# Altium schematic sheet Signal_TX.SchDoc: Signal_TX
size A4
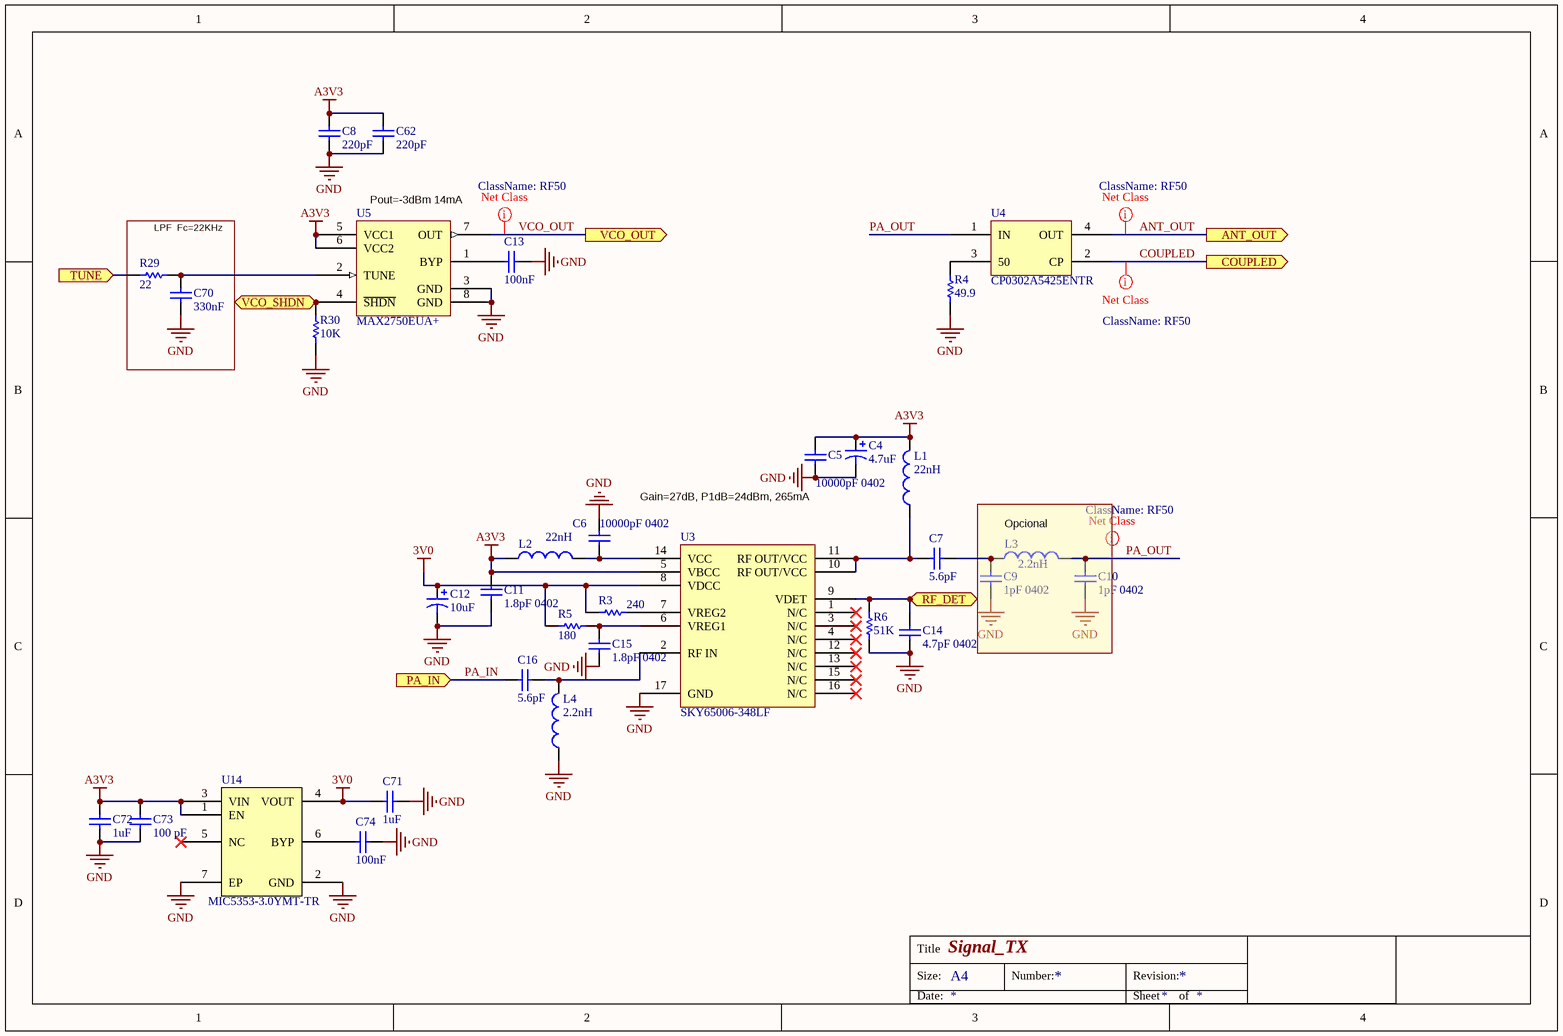
[diagram p0: Signal_TX.SchDoc]

## Parts
C4  4.7uF  [0603 Cap]
C5  10000pF 0402  [RESC1005X04L]
C6  10000pF 0402  [RESC1005X04L]
C7  5.6pF  [RESC1005X04L]
C8  220pF  [0603 Cap]
C9  1pF 0402  [CAPC1005X05L]
C10  1pF 0402  [CAPC1005X05L]
C11  1.8pF 0402  [CAPC1005X05L]
C12  10uF  [CAPC3216X09L]
C13  100nF  [0603 Cap]
C14  4.7pF 0402  [RESC1005X04L]
C15  1.8pF 0402  [CAPC1005X05L]
C16  5.6pF  [RESC1005X04L]
C62  220pF  [0603 Cap]
C70  330nF  [0603 Cap]
C71  1uF  [0603 Cap]
C72  1uF  [0603 Cap]
C73  100 pF  [CAPC1005X05L]
C74  100nF  [0603 Cap]
L1  22nH  [RESC1005X04L]
L2  22nH  [RESC1005X04L]
L3  2.2nH  [RESC1005X04L]
L4  2.2nH  [RESC1005X04L]
R3  240  [RESC1005X04L]
R4  49.9  [RESC1005X04L]
R5  180  [RESC1005X04L]
R6  51K  [RESC1005X04L]
R29  22  [0603 Res]
R30  10K  [0603 Res]
U3  SKY65006-348LF  [QFN50P300X300X100_HS-17N]
U4  CP0302A5425ENTR  [DFN60P65X25-4N]
U5  MAX2750EUA+  [uSOP-8 uMAX]
U14  MIC5353-3.0YMT-TR  [SON50P160X55_HS-7N]

## Blocks framed on the sheet
LPF  Fc=22KHz: C70 R29
Opcional: C9 C10 L3

## Ports
ANT_OUT (out), COUPLED (out), PA_IN (in), RF_DET (out), TUNE (in), VCO_OUT (out), VCO_SHDN (in)

## Nets
3V0: C12.1 C71.1 R3.2 R5.2 U3.8(VDCC) U14.4(VOUT)
A3V3: C4.1 C5.2 C8.2 C11.2 C62.2 C72.2 C73.2 L1.2 L2.1 U3.5(VBCC) U5.5(VCC1) U5.6(VCC2) U14.1(EN) U14.3(VIN)
GND: C4.2 C5.1 C6.2 C8.1 C9.1 C10.1 C11.1 C12.2 C13.1 C14.1 C15.1 C62.1 C70.1 C71.2 C72.1 C73.1 C74.2 L4.1 R4.1 R6.1 R30.1 U3.17(GND) U5.3(GND) U5.8(GND) U14.2(GND) U14.7(EP)
ANT_OUT: U4.4(OUT) ; port ANT_OUT
COUPLED: U4.2(CP) ; port COUPLED
PA_IN: C16.1 ; port PA_IN
PA_OUT: C10.2 L3.2 U4.1(IN)
RF_DET: C14.2 R6.2 U3.9(VDET) ; port RF_DET
TUNE: R29.1 ; port TUNE
VCO_OUT: U5.7(OUT) ; port VCO_OUT
VCO_SHDN: R30.2 U5.4(~{SHDN}) ; port VCO_SHDN
NetC6_1: C6.1 L2.2 U3.14(VCC)
NetC7_1: C7.1 L1.1 U3.10(RF_OUT/VCC) U3.11(RF_OUT/VCC)
NetC7_2: C7.2 C9.2 L3.1
NetC13_2: C13.2 U5.1(BYP)
NetC15_2: C15.2 R5.1 U3.6(VREG1)
NetC16_2: C16.2 L4.2 U3.2(RF_IN)
NetC70_2: C70.2 R29.2 U5.2(TUNE)
NetC74_1: C74.1 U14.6(BYP)
NetR3_1: R3.1 U3.7(VREG2)
NetR4_2: R4.2 U4.3(50)

Not connected (* = marked no-connect by the designer): U3 1(N/C)* 3(N/C)* 4(N/C)* 12(N/C)* 13(N/C)* 15(N/C)* 16(N/C)*; U14 5(NC)*

## Layout directives
net class RF50: ANT_OUT, COUPLED, PA_OUT, VCO_OUT

## Notes on the sheet
- (near U5) Pout=-3dBm 14mA
- Gain=27dB, P1dB=24dBm, 265mA
- Title
- Size:
- A4
- Number:
- Revision:
- Date:
- Sheet
- of

## Library data of the parts
C4 = F981A475MMA: CAP TANT 4.7UF 10V 20% 0603; Manufacturer: AVX Corporation; Manufacturer Size Code: M; Type: Molded; ESR (Equivalent Series Resistance): 6 Ohm; Supplier 1: Digi-Key; Manufacturer Part Number: F981A475MMA; RoHS: RoHS Compliant; Category: Capacitors; Stock 1: 44000; Pricing 1: 4000=0.15246, 8000=0.1423, 12000=0.13975, 28000=0.13721 (EUR); Packaging: Tape & Reel (TR); Part Status: Active; Tolerance: ±20%; Operating Temperature: -55°C ~ 125°C; Lifetime @ Temp.: -; Mounting Type: Surface Mount; Package / Case: 0603 (1608 Metric); Size / Dimension: 0.063" L x 0.033" W (1.60mm x 0.85mm); Height - Seated (Max): 0.035" (0.90mm); Lead Spacing: -; Features: General Purpose; Failure Rate: -; ComponentLink1URL: http://datasheets.avx.com/F98.pdf; ComponentLink1Description: http://datasheets.avx.com/F98.pdf; Supplier Part Number 1: 478-8651-2-ND
C5 C6 = GRM155R71E103KA01J: CAP CER 10000PF 25V X7R 0402; Manufacturer: Murata Electronics North America; Tolerance: ±10%; Supplier 1: Digi-Key; Manufacturer Part Number: GRM155R71E103KA01J; RoHS: RoHS Compliant; Category: Capacitors; Stock 1: 146109; Pricing 1: 1=0.16, 10=0.021, 100=0.009, 500=0.00648, 1000=0.0051, 2500=0.00463, 5000=0.00426 (EUR); Packaging: Digi-Reel®; Part Status: Active; Voltage - Rated: 25V; Temperature Coefficient: X7R; Operating Temperature: -55°C ~ 125°C; Features: -; Ratings: -; Applications: General Purpose; Mounting Type: Surface Mount, MLCC; Package / Case: 0402 (1005 Metric); Size / Dimension: 0.039" L x 0.020" W (1.00mm x 0.50mm); Height - Seated (Max): -; Thickness (Max): 0.022" (0.55mm); Lead Spacing: -; ComponentLink1URL: http://www.murata.com/~/media/webrenewal/support/library/catalog/products/capacitor/mlcc/c02e.ashx; ComponentLink1Description: http://www.murata.com/~/media/webrenewal/support/library/catalog/products/capacitor/mlcc/c02e.ashx; Supplier Part Number 1: 490-6341-6-ND
C7 C16 = 04025A5R6CAT2A: AVX - 04025A5R6CAT2A - COND, MLCC, C0G/NP0, 5.6PF, 50V, 0402; Tolerance: ±10%; Voltage - Rated: 25V; Temperature Coefficient: X7R; Supplier 1: Farnell; Manufacturer: AVX; Manufacturer Part Number: 04025A5R6CAT2A; RoHS: YES; Stock 1: 52484; Pricing 1: 10=0,187, 100=0,0374, 500=0,015, 2500=0,0094, 5000=0,0075 (EUR); ComponentLink1URL: http://www.avx.com/docs/Catalogs/cpack.pdf; ComponentLink1Description: http://www.avx.com/docs/Catalogs/cpack.pdf; ComponentLink2URL: http://www.farnell.com/datasheets/2068140.pdf; ComponentLink2Description: http://www.farnell.com/datasheets/2068140.pdf; Supplier Part Number 1: 1327642; Supplier 2: Digi-Key; Category: Capacitors; Stock 2: 146109; Pricing 2: 1=0.16, 10=0.021, 100=0.009, 500=0.00648, 1000=0.0051, 2500=0.00463, 5000=0.00426 (EUR); Packaging: Cut Tape (CT); Part Status: Active; Operating Temperature: -55°C ~ 125°C; Features: -; Ratings: -; Applications: General Purpose; Mounting Type: Surface Mount, MLCC; Package / Case: 0402 (1005 Metric); Size / Dimension: 0.039" L x 0.020" W (1.00mm x 0.50mm); Height - Seated (Max): -; Thickness (Max): 0.022" (0.55mm); Lead Spacing: -; ComponentLink3URL: http://www.murata.com/~/media/webrenewal/support/library/catalog/products/capacitor/mlcc/c02e.ashx; ComponentLink3Description: http://www.murata.com/~/media/webrenewal/support/library/catalog/products/capacitor/mlcc/c02e.ashx; Supplier Part Number 2: 490-6341-1-ND
C8 C62 = CL10B221KB8WPNC: CAP CER 220PF 50V X7R 0603; Manufacturer: Samsung Electro-Mechanics America, Inc.; Tolerance: ±10%; Supplier 1: Digi-Key; Manufacturer Part Number: CL10B221KB8WPNC; RoHS: RoHS Compliant; Category: Capacitors; Stock 1: 28547; Pricing 1: 1=0.09, 10=0.027, 100=0.0123, 500=0.0088, 1000=0.00691 (EUR); Packaging: Cut Tape (CT); Part Status: Active; Voltage - Rated: 50V; Temperature Coefficient: X7R; Operating Temperature: -55°C ~ 125°C; Features: Open Mode, Soft Termination; Ratings: AEC-Q200; Applications: Automotive, Boardflex Sensitive; Mounting Type: Surface Mount, MLCC; Package / Case: 0603 (1608 Metric); Size / Dimension: 0.063" L x 0.031" W (1.60mm x 0.80mm); Height - Seated (Max): -; Thickness (Max): 0.035" (0.90mm); Lead Spacing: -; Lead Style: -; ComponentLink1URL: http://www.samsungsem.com/kr/support/library/product-catalog/mlcc.jsp; ComponentLink1Description: http://www.samsungsem.com/kr/support/library/product-catalog/mlcc.jsp; Supplier Part Number 1: 1276-6536-1-ND
C9 C10 = GRM1555C1H1R0CA01D: CAP CER 1PF 50V C0G/NP0 0402
C11 C15 = GRM1555C1H1R8CZ01D: CAP CER 1.8PF 50V C0G/NP0 0402; Manufacturer: Murata Electronics North America; Tolerance: ±0.25pF; Temperature Coefficient: C0G, NP0; Type: Multilayer; Material - Core: Non-Magnetic; Inductance: 22nH; Current Rating: 200mA; Shielding: Unshielded; DC Resistance (DCR): 700 mOhm Max; Q @ Freq: 7 @ 100MHz; Frequency - Self Resonant: 3.5GHz; Supplier 1: Digi-Key; Manufacturer Part Number: GRM1555C1H1R8CZ01D; RoHS: RoHS Compliant; Category: Capacitors; Stock 1: 0; Pricing 1: 1=0 (EUR); Packaging: Cut Tape (CT); Part Status: Obsolete; Voltage - Rated: 50V; Operating Temperature: -55°C ~ 125°C; Features: -; Ratings: -; Applications: General Purpose; Mounting Type: Surface Mount, MLCC; Package / Case: 0402 (1005 Metric); Size / Dimension: 0.039" L x 0.020" W (1.00mm x 0.50mm); Height - Seated (Max): -; Thickness (Max): 0.022" (0.55mm); Lead Spacing: -; Lead Style: -; ComponentLink1URL: http://media.digikey.com/pdf/Data%20Sheets/Murata%20PDFs/Chip_Mono_Cer_Caps_C02e_Rev_Dec2016.pdf; ComponentLink1Description: http://media.digikey.com/pdf/Data%20Sheets/Murata%20PDFs/Chip_Mono_Cer_Caps_C02e_Rev_Dec2016.pdf; Supplier Part Number 1: 490-3203-1-ND; Current - Saturation: -; Supplier Device Package: 0402 (1005 Metric); ComponentLink2URL: https://product.tdk.com/info/en/catalog/datasheets/inductor_commercial_high-frequency_mlk1005_en.pdf; ComponentLink2Description: https://product.tdk.com/info/en/catalog/datasheets/inductor_commercial_high-frequency_mlk1005_en.pdf
C12 = TAJA106M006RNJ: CAP TANT 10UF 6.3V 20% 1206; Manufacturer: AVX Corporation; Manufacturer Size Code: A; Type: Molded; ESR (Equivalent Series Resistance): 4 Ohm; Supplier 1: Digi-Key; Manufacturer Part Number: TAJA106M006RNJ; RoHS: RoHS Compliant; Category: Capacitors; Stock 1: 16813; Pricing 1: 1=0.47, 10=0.326, 100=0.2146, 500=0.15896, 1000=0.13512 (EUR); Packaging: Cut Tape (CT); Part Status: Active; Tolerance: ±20%; Operating Temperature: -55°C ~ 125°C; Lifetime @ Temp.: -; Mounting Type: Surface Mount; Package / Case: 1206 (3216 Metric); Size / Dimension: 0.126" L x 0.063" W (3.20mm x 1.60mm); Height - Seated (Max): 0.071" (1.80mm); Lead Spacing: -; Features: General Purpose; Failure Rate: -; ComponentLink1URL: http://datasheets.avx.com/TAJ.pdf; ComponentLink1Description: http://datasheets.avx.com/TAJ.pdf; Supplier Part Number 1: 478-1656-1-ND
C13 C74 = C0603C104K4RACTU: CAP CER 0.1UF 16V X7R 0603; Manufacturer: KEMET; Capacitance: 0.1µF; Tolerance: ±10%; Supplier 1: Digi-Key; Manufacturer Part Number: C0603C104K4RACTU; RoHS: RoHS Compliant; Category: Capacitors; Stock 1: 4491346; Pricing 1: 1=0.09, 10=0.022, 25=0.016, 50=0.0122, 100=0.01, 250=0.00836, 500=0.0071, 1000=0.00559 (EUR); Packaging: Digi-Reel®; Part Status: Active; Voltage - Rated: 16V; Temperature Coefficient: X7R; Operating Temperature: -55°C ~ 125°C; Features: -; Ratings: -; Applications: General Purpose; Failure Rate: -; Mounting Type: Surface Mount, MLCC; Package / Case: 0603 (1608 Metric); Size / Dimension: 0.063" L x 0.031" W (1.60mm x 0.80mm); Height - Seated (Max): -; Thickness (Max): 0.034" (0.87mm); Lead Spacing: -; Lead Style: -; ComponentLink1URL: http://www.kemet.com/docfinder?Partnumber=C0603C104K4RACTU; ComponentLink1Description: http://www.kemet.com/docfinder?Partnumber=C0603C104K4RACTU; Supplier Part Number 1: 399-1096-6-ND
C14 = GRM1555C1H4R7CA01D: CAP CER 4.7PF 50V C0G/NP0 0402; Manufacturer: Murata Electronics North America; Tolerance: ±0.25pF; Temperature Coefficient: C0G, NP0; Supplier 1: Digi-Key; Manufacturer Part Number: GRM1555C1H4R7CA01D; RoHS: RoHS Compliant; Category: Capacitors; Stock 1: 136694; Pricing 1: 1=0.11, 10=0.022, 100=0.01, 500=0.00714, 1000=0.00562, 2500=0.00511, 5000=0.0047 (EUR); Packaging: Cut Tape (CT); Part Status: Active; Voltage - Rated: 50V; Operating Temperature: -55°C ~ 125°C; Features: -; Ratings: -; Applications: General Purpose; Mounting Type: Surface Mount, MLCC; Package / Case: 0402 (1005 Metric); Size / Dimension: 0.039" L x 0.020" W (1.00mm x 0.50mm); Height - Seated (Max): -; Thickness (Max): 0.022" (0.55mm); Lead Spacing: -; Lead Style: -; ComponentLink1URL: http://www.murata.com/~/media/webrenewal/support/library/catalog/products/capacitor/mlcc/c02e.ashx; ComponentLink1Description: http://www.murata.com/~/media/webrenewal/support/library/catalog/products/capacitor/mlcc/c02e.ashx; Supplier Part Number 1: 490-5874-1-ND
C70 = CC0603KRX7R7BB334: CAP CER 0.33UF 16V X7R 0603; Manufacturer: Yageo; Capacitance: 0.33µF; Tolerance: ±10%; Supplier 1: Digi-Key; Manufacturer Part Number: CC0603KRX7R7BB334; RoHS: RoHS Compliant; Category: Capacitors; Stock 1: 26937; Pricing 1: 1=0.09, 10=0.065, 25=0.0476, 50=0.0358, 100=0.0292, 250=0.0244, 500=0.02084, 1000=0.01637 (EUR); Packaging: Digi-Reel®; Part Status: Active; Voltage - Rated: 16V; Temperature Coefficient: X7R; Operating Temperature: -55°C ~ 125°C; Features: -; Ratings: -; Applications: General Purpose; Failure Rate: -; Mounting Type: Surface Mount, MLCC; Package / Case: 0603 (1608 Metric); Size / Dimension: 0.063" L x 0.031" W (1.60mm x 0.80mm); Height - Seated (Max): -; Thickness (Max): 0.035" (0.90mm); Lead Spacing: -; Lead Style: -; ComponentLink1URL: http://www.yageo.com/documents/recent/UPY-GPHC_X7R_6.3V-to-50V_17.pdf; ComponentLink1Description: http://www.yageo.com/documents/recent/UPY-GPHC_X7R_6.3V-to-50V_17.pdf; Supplier Part Number 1: 311-2081-6-ND
C71 C72 = CL10B105MO8NNWC: CAP CER 1UF 16V X7R 0603; Manufacturer: Samsung Electro-Mechanics America, Inc.; Capacitance: 1µF; Tolerance: ±20%; Supplier 1: Digi-Key; Manufacturer Part Number: CL10B105MO8NNWC; RoHS: RoHS Compliant; Category: Capacitors; Stock 1: 77746; Pricing 1: 1=0.09, 10=0.02, 25=0.0144, 50=0.0108, 100=0.0089, 250=0.00744, 500=0.00636, 1000=0.00499 (EUR); Packaging: Digi-Reel®; Part Status: Active; Voltage - Rated: 16V; Temperature Coefficient: X7R; Operating Temperature: -55°C ~ 125°C; Features: -; Ratings: -; Applications: General Purpose; Mounting Type: Surface Mount, MLCC; Package / Case: 0603 (1608 Metric); Size / Dimension: 0.063" L x 0.031" W (1.60mm x 0.80mm); Height - Seated (Max): -; Thickness (Max): 0.035" (0.90mm); Lead Spacing: -; Lead Style: -; ComponentLink1URL: http://www.samsungsem.com/kr/support/library/product-catalog/__icsFiles/afieldfile/2016/09/27/MLCC.pdf; ComponentLink1Description: http://www.samsungsem.com/kr/support/library/product-catalog/__icsFiles/afieldfile/2016/09/27/MLCC.pdf; Supplier Part Number 1: 1276-6524-6-ND
C73 = CL05C101JB5NNNC: CAP CER 100PF 50V 5% NP0 0402; Manufacturer: Samsung Electro-Mechanics America, Inc; Temperature Coefficient: C0G, NP0; Supplier 1: Digi-Key; Supplier Part Number 1: 1276-1025-1-ND; Manufacturer Part Number: CL05C101JB5NNNC; RoHS: RoHS Compliant; Category: Capacitors; Stock 1: 969963; Pricing 1: 1=0.09, 10=0.011, 25=0.008, 100=0.0052, 500=0.00366, 1000=0.00285, 2500=0.00256, 5000=0.00238 (EUR); Packaging: Cut Tape (CT); Capacitance: 100pF; Tolerance: ±5%; Voltage - Rated: 50V; Mounting Type: Surface Mount, MLCC; Operating Temperature: -55°C ~ 125°C; Applications: General Purpose; Ratings: -; Package / Case: 0402 (1005 Metric); Size / Dimension: 0.039" L x 0.020" W (1.00mm x 0.50mm); Height - Seated (Max): -; Thickness (Max): 0.022" (0.55mm); Lead Spacing: -; Features: -; Lead Style: -; ComponentLink1URL: http://www.samsungsem.com/servlet/FileDownload?type=spec&file=CL05C101JB5NNNC.pdf; ComponentLink1Description: http://www.samsungsem.com/servlet/FileDownload?type=spec&file=CL05C101JB5NNNC.pdf
L1 L2 = MLK1005S22NJT000: FIXED IND 22NH 200MA 700 MOHM
L3 L4 = MLK1005S2N2ST000: FIXED IND 2.2NH 500MA 180 MOHM; Manufacturer: TDK Corporation; Type: Multilayer; Material - Core: Non-Magnetic; Tolerance: ±0.3nH; Shielding: Unshielded; DC Resistance (DCR): 180 mOhm Max; Q @ Freq: 6 @ 100MHz; Frequency - Self Resonant: 8GHz; Resistance (Ohms): 180; Power (Watts): 0.1W, 1/10W; Temperature Coefficient: ±200ppm/°C; Supplier 1: Digi-Key; Manufacturer Part Number: MLK1005S2N2ST000; RoHS: RoHS Compliant; Category: Inductors, Coils, Chokes; Stock 1: 20000; Pricing 1: 10000=0.01404, 30000=0.0136, 50000=0.01316, 100000=0.01273 (EUR); Packaging: Tape & Reel (TR); Part Status: Active; Inductance: 2.2nH; Current Rating: 500mA; Current - Saturation: -; Ratings: -; Operating Temperature: -55°C ~ 125°C; Mounting Type: Surface Mount; Package / Case: 0402 (1005 Metric); Supplier Device Package: 0402 (1005 Metric); Size / Dimension: 0.039" L x 0.020" W (1.00mm x 0.50mm); Height - Seated (Max): 0.024" (0.60mm); ComponentLink1URL: https://product.tdk.com/info/en/catalog/datasheets/inductor_commercial_high-frequency_mlk1005_en.pdf; ComponentLink1Description: https://product.tdk.com/info/en/catalog/datasheets/inductor_commercial_high-frequency_mlk1005_en.pdf; Supplier Part Number 1: 445-1459-2-ND; Composition: Thick Film; Features: Automotive AEC-Q200; Failure Rate: -; ComponentLink2URL: http://industrial.panasonic.com/www-cgi/jvcr13pz.cgi?E+PZ+3+AOA0001+ERJ2GEJ181X+7+WW; ComponentLink2Description: http://industrial.panasonic.com/www-cgi/jvcr13pz.cgi?E+PZ+3+AOA0001+ERJ2GEJ181X+7+WW
R3 = ERJ-2GEJ241X: RES SMD 240 OHM 5% 1/10W 0402; Manufacturer: Panasonic Electronic Components; Power (Watts): 0.1W, 1/10W; Temperature Coefficient: ±200ppm/°C; Supplier 1: Digi-Key; Manufacturer Part Number: ERJ-2GEJ241X; RoHS: RoHS Compliant; Category: Resistors; Stock 1: 99765; Pricing 1: 1=0.09, 10=0.018, 100=0.007, 1000=0.00315, 2500=0.00274, 5000=0.00226 (EUR); Packaging: Cut Tape (CT); Part Status: Active; Resistance (Ohms): 240; Tolerance: ±5%; Composition: Thick Film; Features: Automotive AEC-Q200; Operating Temperature: -55°C ~ 155°C; Package / Case: 0402 (1005 Metric); Supplier Device Package: 0402; Size / Dimension: 0.039" L x 0.020" W (1.00mm x 0.50mm); Height - Seated (Max): 0.016" (0.40mm); Failure Rate: -; ComponentLink1URL: http://industrial.panasonic.com/www-cgi/jvcr13pz.cgi?E+PZ+3+AOA0001+ERJ2GEJ241X+7+WW; ComponentLink1Description: http://industrial.panasonic.com/www-cgi/jvcr13pz.cgi?E+PZ+3+AOA0001+ERJ2GEJ241X+7+WW; Supplier Part Number 1: P240JCT-ND
R4 = MCR01MRTF49R9: RES 49.9 OHM 1/16W 1% 0402 SMD; Manufacturer: Rohm Semiconductor; Power (Watts): 0.063W, 1/16W; Temperature Coefficient: ±100ppm/°C; Supplier 1: Digi-Key; Supplier Part Number 1: RHM49.9CDCT-ND; Manufacturer Part Number: MCR01MRTF49R9; RoHS: RoHS Compliant; Category: Resistors; Stock 1: 141395; Pricing 1: 1=0.09, 10=0.011, 25=0.008, 100=0.0046, 250=0.00348, 500=0.00278, 1000=0.00205, 5000=0.00147 (EUR); Packaging: Cut Tape (CT); Resistance (Ohms): 49.9; Tolerance: ±1%; Composition: Thick Film; Features: -; Operating Temperature: -55°C ~ 155°C; Package / Case: 0402 (1005 Metric); Supplier Device Package: 0402 (1005 Metric); Size / Dimension: 0.039" L x 0.020" W (1.00mm x 0.50mm); Height: 0.016" (0.40mm); Number of Terminations: 2; ComponentLink1URL: http://rohmfs.rohm.com/en/products/databook/datasheet/passive/resistor/chip_resistor/mcr_g.pdf; ComponentLink1Description: http://rohmfs.rohm.com/en/products/databook/datasheet/passive/resistor/chip_resistor/mcr_g.pdf
R5 = ERJ-2GEJ181X: RES SMD 180 OHM 5% 1/10W 0402
R6 = ERJ-2GEJ513X: RES SMD 51K OHM 5% 1/10W 0402; Manufacturer: Panasonic Electronic Components; Power (Watts): 0.1W, 1/10W; Temperature Coefficient: ±200ppm/°C; Supplier 1: Digi-Key; Manufacturer Part Number: ERJ-2GEJ513X; RoHS: RoHS Compliant; Category: Resistors; Stock 1: 2648; Pricing 1: 1=0.09, 10=0.018, 100=0.007, 1000=0.00315, 2500=0.00274, 5000=0.00226 (EUR); Packaging: Cut Tape (CT); Part Status: Active; Resistance (Ohms): 51k; Tolerance: ±5%; Composition: Thick Film; Features: Automotive AEC-Q200; Operating Temperature: -55°C ~ 155°C; Package / Case: 0402 (1005 Metric); Supplier Device Package: 0402; Size / Dimension: 0.039" L x 0.020" W (1.00mm x 0.50mm); Height - Seated (Max): 0.016" (0.40mm); Failure Rate: -; ComponentLink1URL: http://industrial.panasonic.com/www-cgi/jvcr13pz.cgi?E+PZ+3+AOA0001+ERJ2GEJ513X+7+WW; ComponentLink1Description: http://industrial.panasonic.com/www-cgi/jvcr13pz.cgi?E+PZ+3+AOA0001+ERJ2GEJ513X+7+WW; Supplier Part Number 1: P51KJCT-ND
R29 = RC0603FR-0722RL: RES SMD 22 OHM 1% 1/10W 0603; Manufacturer: Yageo; Power (Watts): 0.1W, 1/10W; Temperature Coefficient: ±100ppm/°C; Supplier 1: Digi-Key; Manufacturer Part Number: RC0603FR-0722RL; RoHS: RoHS Compliant; Category: Resistors; Stock 1: 1781352; Pricing 1: 1=0.09, 10=0.012, 25=0.0088, 50=0.0066, 100=0.0049, 250=0.00372, 500=0.00296, 1000=0.00218 (EUR); Packaging: Cut Tape (CT); Part Status: Active; Resistance (Ohms): 22; Tolerance: ±1%; Composition: Thick Film; Features: Moisture Resistant; Operating Temperature: -55°C ~ 155°C; Package / Case: 0603 (1608 Metric); Supplier Device Package: 0603; Size / Dimension: 0.063" L x 0.031" W (1.60mm x 0.80mm); Height - Seated (Max): 0.022" (0.55mm); Failure Rate: -; ComponentLink1URL: http://www.yageo.com/documents/recent/PYu-RC_Group_51_RoHS_L_7.pdf; ComponentLink1Description: http://www.yageo.com/documents/recent/PYu-RC_Group_51_RoHS_L_7.pdf; Supplier Part Number 1: 311-22.0HRCT-ND
R30 = RC0603FR-0710KL: RES SMD 10K OHM 1% 1/10W 0603; Manufacturer: Yageo; Power (Watts): 0.1W, 1/10W; Temperature Coefficient: ±100ppm/°C; Supplier 1: Digi-Key; Manufacturer Part Number: RC0603FR-0710KL; RoHS: RoHS Compliant; Category: Resistors; Stock 1: 17023109; Pricing 1: 1=0.09, 10=0.012, 25=0.0088, 50=0.0066, 100=0.0049, 250=0.00372, 500=0.00296, 1000=0.00218 (EUR); Packaging: Cut Tape (CT); Part Status: Active; Resistance (Ohms): 10k; Tolerance: ±1%; Composition: Thick Film; Features: Moisture Resistant; Operating Temperature: -55°C ~ 155°C; Package / Case: 0603 (1608 Metric); Supplier Device Package: 0603; Size / Dimension: 0.063" L x 0.031" W (1.60mm x 0.80mm); Height - Seated (Max): 0.022" (0.55mm); Failure Rate: -; ComponentLink1URL: http://www.yageo.com/documents/recent/PYu-RC_Group_51_RoHS_L_7.pdf; ComponentLink1Description: http://www.yageo.com/documents/recent/PYu-RC_Group_51_RoHS_L_7.pdf; Supplier Part Number 1: 311-10.0KHRCT-ND
U3 = SKY65006-348LF: PA: Linear, high-gain two-stage power  amplifier with integrated output power detector and second  harmonic (F2) filter; Manufacturer: Broadcom Limited; Manufacturer Part Number: MGA-13216-BLKG; Frequency: 1.5GHz ~ 2.5GHz; P1dB: 23.6dB; Gain: 35.8dB; Noise Figure: 0.61dB; RF Type: CDMA, GSM, WCDMA; Voltage - Supply: 5V; Current - Supply: 122mA; Test Frequency: 1.95GHz; RoHS: RoHS Compliant; Category: RF/IF and RFID; Packaging: Cut Strip; Part Status: Active; Package / Case: 16-VQFN Exposed Pad; Supplier Device Package: 16-QFN (4x4); ComponentLink1URL: https://docs.broadcom.com/docs/AV02-2878EN; ComponentLink1Description: https://docs.broadcom.com/docs/AV02-2878EN; Supplier 1: Digi-Key; Supplier Part Number 1: 863-1772-1-ND
U4 = CP0302A5425ENTR: WIFI COUPLER 0302; Manufacturer: AVX Corporation; Coupler Type: Standard; Frequency: 2.4GHz ~ 2.5GHz, 4.9GHz ~ 5.95GHz; Coupling Factor: 20dB; Insertion Loss: 0.4dB; Return Loss: 30dB; Supplier 1: Digi-Key; Manufacturer Part Number: CP0302A5425ENTR; RoHS: RoHS Compliant; Category: RF/IF and RFID; Stock 1: 8267; Pricing 1: 1=0.48, 10=0.428, 25=0.3872, 100=0.3387, 250=0.2972, 500=0.26264, 1000=0.20733 (EUR); Packaging: Cut Tape (CT); Part Status: Active; Applications: General Purpose; Power - Max: -; Isolation: -; Package / Case: 0302 (0806 Metric), 4 Lead; Supplier Device Package: -; ComponentLink1URL: http://datasheets.avx.com/cp0302.pdf; ComponentLink1Description: http://datasheets.avx.com/cp0302.pdf; Supplier Part Number 1: 478-9329-1-ND
U5 = MAX2750EUA+: IC OSC VOLT CNTRL 8-UMAX; Manufacturer: Maxim Integrated; Function: VCO; Frequency: 2.4GHz ~ 2.5GHz; RF Type: ISM; Secondary Attributes: On-Chip Tank Circuit; Supplier 1: Digi-Key; Manufacturer Part Number: MAX2750EUA+; RoHS: RoHS Compliant; Category: RF/IF and RFID; Stock 1: 2116; Pricing 1: 1=4.43, 10=4.21, 25=3.4664, 50=3.2932, 250=3.19312, 500=2.83092 (EUR); Packaging: Tube; Part Status: Active; Package / Case: 8-TSSOP, 8-MSOP (0.118", 3.00mm Width); Supplier Device Package: 8-uMAX; ComponentLink1URL: http://datasheets.maximintegrated.com/en/ds/MAX2750-MAX2752.pdf; ComponentLink1Description: http://datasheets.maximintegrated.com/en/ds/MAX2750-MAX2752.pdf; Supplier Part Number 1: MAX2750EUA+-ND
U14 = MIC5353-3.0YMT-TR: IC REG LINEAR 3V 500MA 6TMLF; Manufacturer: Microchip Technology; Output Configuration: Positive; Output Type: Fixed; Voltage - Input (Max): 6V; Voltage Dropout (Max): 0.35V @ 500mA; PSRR: 60dB (1kHz); Control Features: Enable; Protection Features: Over Current, Over Temperature; Current - Supply: 175µA; Supplier 1: Digi-Key; Manufacturer Part Number: MIC5353-3.0YMT-TR; RoHS: RoHS Compliant; Category: Integrated Circuits (ICs); Stock 1: 5148; Pricing 1: 1=0.3, 25=0.244, 100=0.2265 (EUR); Packaging: Cut Tape (CT); Part Status: Active; Voltage - Output (Min/Fixed): 3V; Voltage - Output (Max): -; Current - Output: 500mA; Operating Temperature: -40°C ~ 125°C; Mounting Type: Surface Mount; Package / Case: 6-UFDFN Exposed Pad, 6-TMLF®; Supplier Device Package: 6-TMLF® (1.6x1.6); ComponentLink1URL: http://www.microchip.com/mymicrochip/filehandler.aspx?ddocname=en579989; ComponentLink1Description: http://www.microchip.com/mymicrochip/filehandler.aspx?ddocname=en579989; Supplier Part Number 1: 576-3679-1-ND